# EAGLE design generic_control_board (EAGLE 5.01)
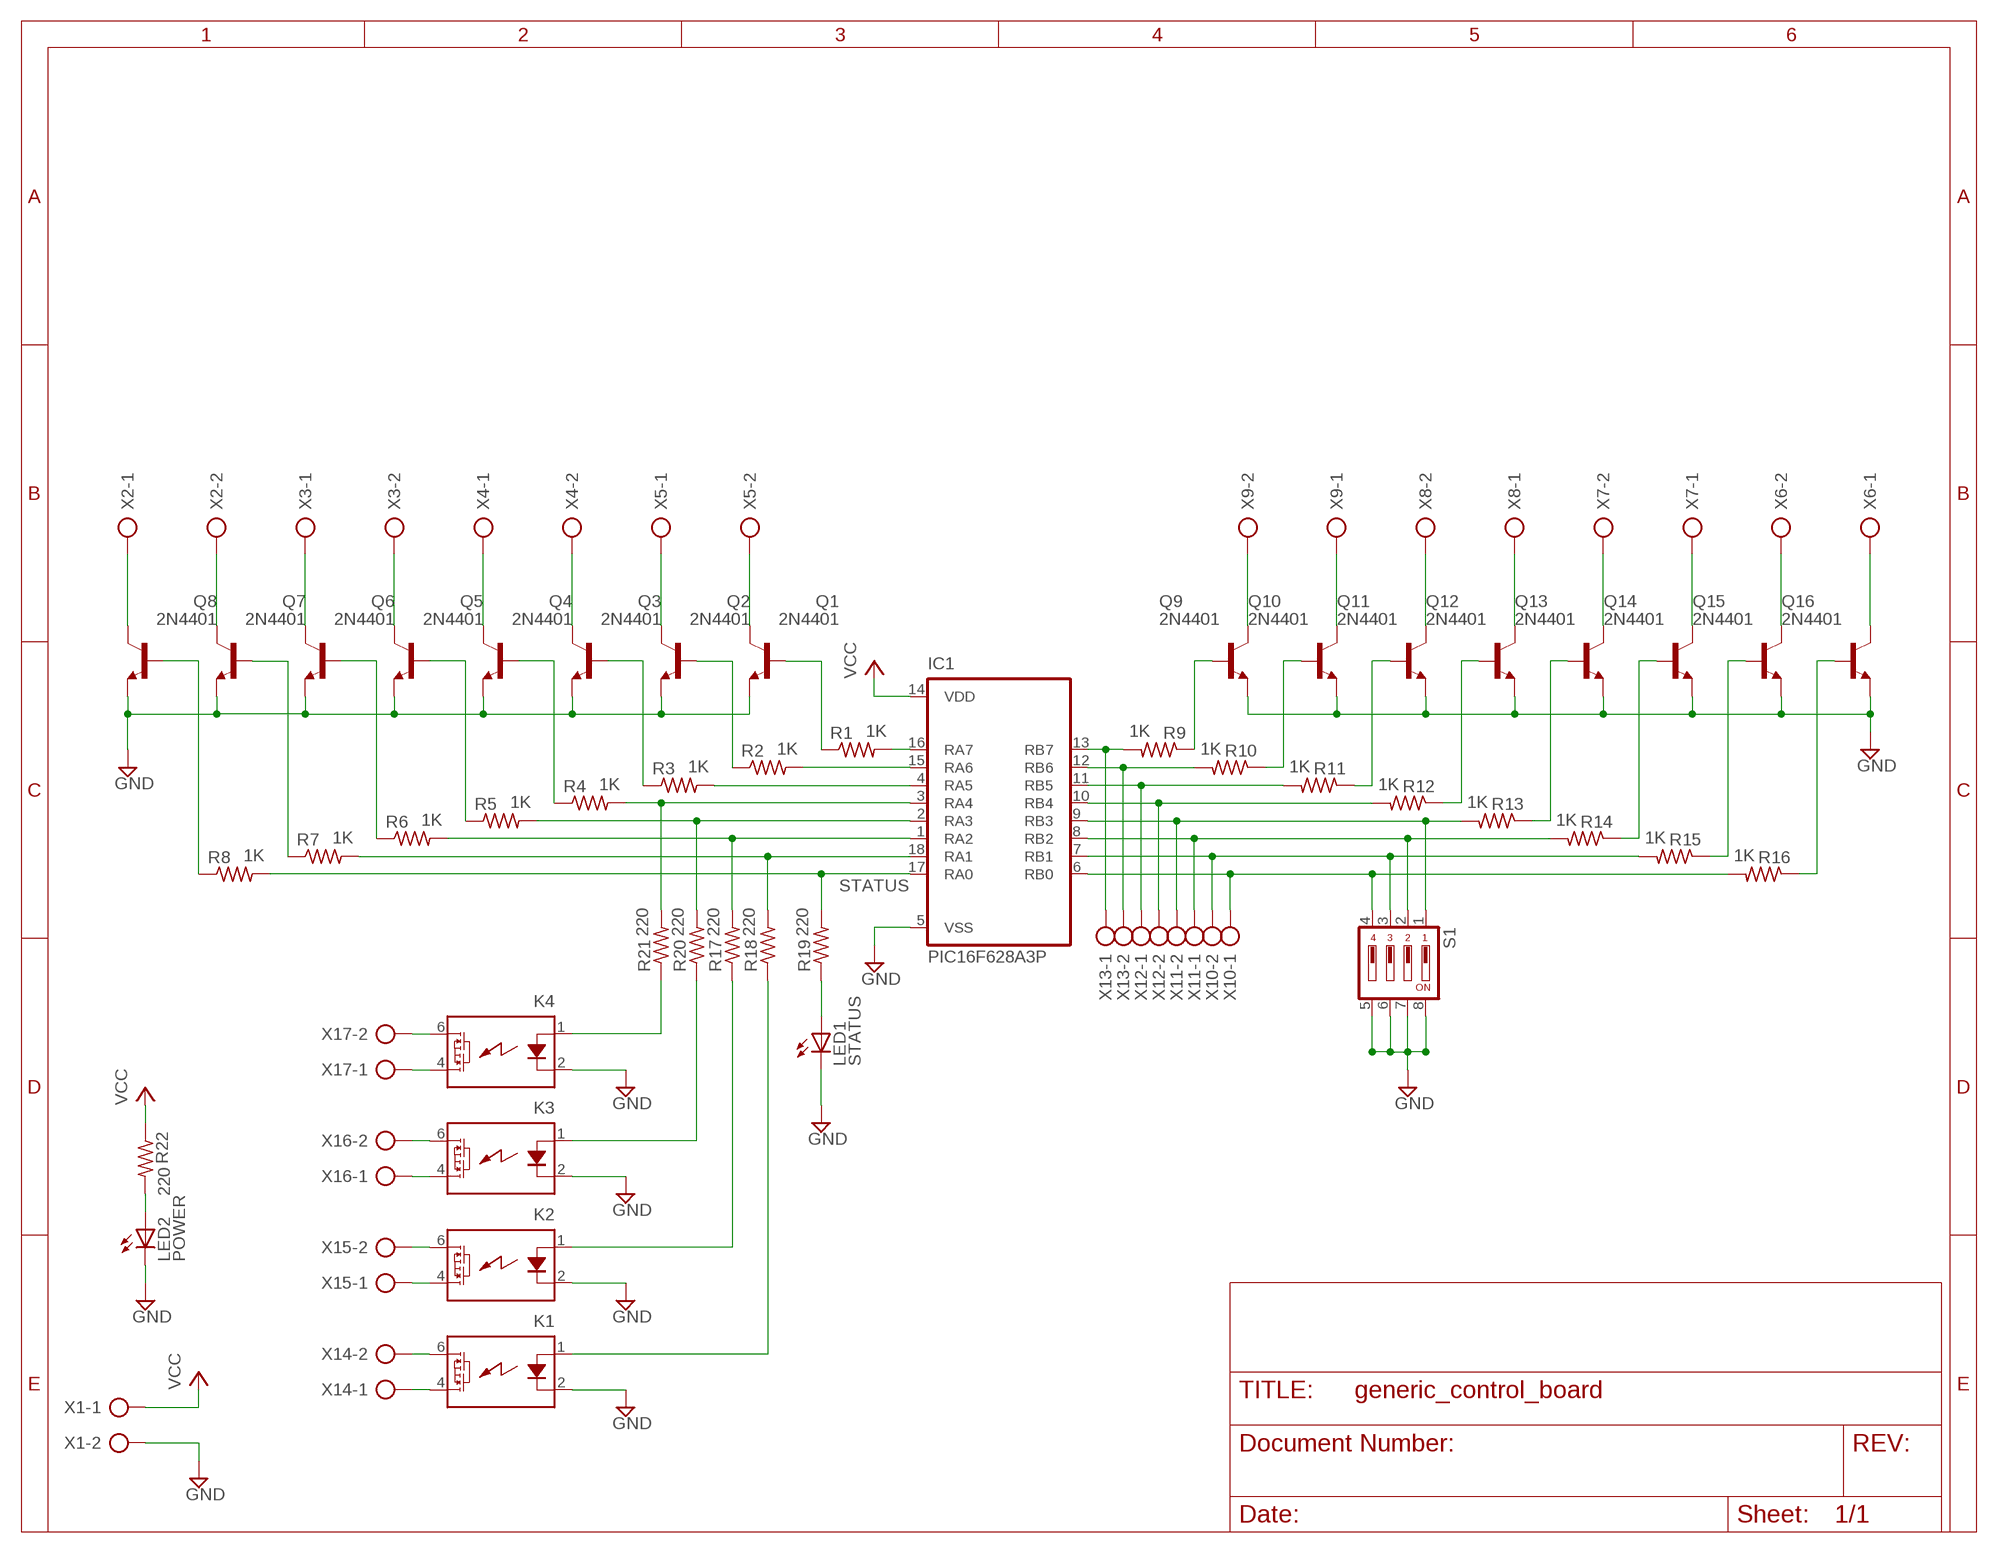
[diagram p0: schematic, sheet 1]

## Parts
IC1  PIC16F628A3P  [DIL18]
K1  LCA110  [DIL06]
K2  LCA110  [DIL06]
K3  LCA110  [DIL06]
K4  LCA110  [DIL06]
LED1  STATUS  LED3MM  [LED3MM]
LED2  POWER  LED3MM  [LED3MM]
Q1  2N4401  [TO92]
Q2  2N4401  [TO92]
Q3  2N4401  [TO92]
Q4  2N4401  [TO92]
Q5  2N4401  [TO92]
Q6  2N4401  [TO92]
Q7  2N4401  [TO92]
Q8  2N4401  [TO92]
Q9  2N4401  [TO92]
Q10  2N4401  [TO92]
Q11  2N4401  [TO92]
Q12  2N4401  [TO92]
Q13  2N4401  [TO92]
Q14  2N4401  [TO92]
Q15  2N4401  [TO92]
Q16  2N4401  [TO92]
R1  1K  R-US_0207/2V  [0207/2V]
R2  1K  R-US_0207/2V  [0207/2V]
R3  1K  R-US_0207/2V  [0207/2V]
R4  1K  R-US_0207/2V  [0207/2V]
R5  1K  R-US_0207/2V  [0207/2V]
R6  1K  R-US_0207/2V  [0207/2V]
R7  1K  R-US_0207/2V  [0207/2V]
R8  1K  R-US_0207/2V  [0207/2V]
R9  1K  R-US_0207/2V  [0207/2V]
R10  1K  R-US_0207/2V  [0207/2V]
R11  1K  R-US_0207/2V  [0207/2V]
R12  1K  R-US_0207/2V  [0207/2V]
R13  1K  R-US_0207/2V  [0207/2V]
R14  1K  R-US_0207/2V  [0207/2V]
R15  1K  R-US_0207/2V  [0207/2V]
R16  1K  R-US_0207/2V  [0207/2V]
R17  220  R-US_0207/2V  [0207/2V]
R18  220  R-US_0207/2V  [0207/2V]
R19  220  R-US_0207/2V  [0207/2V]
R20  220  R-US_0207/2V  [0207/2V]
R21  220  R-US_0207/2V  [0207/2V]
R22  220  R-US_0207/2V  [0207/2V]
S1  DIP04YL  [DIP04YL]
X1  AK500/2  [AK500/2]
X2  AK500/2  [AK500/2]
X3  AK500/2  [AK500/2]
X4  AK500/2  [AK500/2]
X5  AK500/2  [AK500/2]
X6  AK500/2  [AK500/2]
X7  AK500/2  [AK500/2]
X8  AK500/2  [AK500/2]
X9  AK500/2  [AK500/2]
X10  AK500/2  [AK500/2]
X11  AK500/2  [AK500/2]
X12  AK500/2  [AK500/2]
X13  AK500/2  [AK500/2]
X14  AK500/2  [AK500/2]
X15  AK500/2  [AK500/2]
X16  AK500/2  [AK500/2]
X17  AK500/2  [AK500/2]

## Nets
AC1-A: K1.6(D1) X14.2
AC1-B: K1.4(D2) X14.1
AC2-A: K2.6(D1) X15.2
AC2-B: K2.4(D2) X15.1
AC3-A: K3.6(D1) X16.2
AC3-B: K3.4(D2) X16.1
AC4-A: K4.6(D1) X17.2
AC4-B: K4.4(D2) X17.1
AOUT1: Q8.1(C) X2.1
AOUT2: Q7.1(C) X2.2
AOUT3: Q6.1(C) X3.1
AOUT4: Q5.1(C) X3.2
AOUT5: Q4.1(C) X4.1
AOUT6: Q3.1(C) X4.2
AOUT7: Q2.1(C) X5.1
AOUT8: Q1.1(C) X5.2
BOUT1: Q16.1(C) X6.1
BOUT2: Q15.1(C) X6.2
BOUT3: Q14.1(C) X7.1
BOUT4: Q13.1(C) X7.2
BOUT5: Q12.1(C) X8.1
BOUT6: Q11.1(C) X8.2
BOUT7: Q10.1(C) X9.1
BOUT8: Q9.1(C) X9.2
GND: IC1.5(VSS) K1.2(K) K2.2(K) K3.2(K) K4.2(K) LED1.K(C) LED2.K(C) Q1.3(E) Q2.3(E) Q3.3(E) Q4.3(E) Q5.3(E) Q6.3(E) Q7.3(E) Q8.3(E) Q9.3(E) Q10.3(E) Q11.3(E) Q12.3(E) Q13.3(E) Q14.3(E) Q15.3(E) Q16.3(E) S1.5 S1.6 S1.7 S1.8 X1.2
IN1: IC1.6(RB0) R16.2 S1.4 X10.1
IN2: IC1.7(RB1) R15.2 S1.3 X10.2
IN3: IC1.8(RB2) R14.2 S1.2 X11.1
IN4: IC1.9(RB3) R13.2 S1.1 X11.2
IN5: IC1.10(RB4) R12.2 X12.2
IN6: IC1.11(RB5) R11.2 X12.1
IN7: IC1.12(RB6) R10.2 X13.2
IN8: IC1.13(RB7) R9.2 X13.1
N$3: Q11.2(B) R11.1
N$4: Q8.2(B) R8.1
N$5: Q1.2(B) R1.1
N$7: Q2.2(B) R2.1
N$8: Q3.2(B) R3.1
N$9: Q4.2(B) R4.1
N$10: Q5.2(B) R5.1
N$11: Q12.2(B) R12.1
N$12: Q13.2(B) R13.1
N$13: Q14.2(B) R14.1
N$14: Q6.2(B) R6.1
N$21: IC1.16(RA7) R1.2
N$22: Q7.2(B) R7.1
N$23: Q15.2(B) R15.1
N$24: IC1.15(RA6) R2.2
N$26: IC1.4(RA5) R3.2
N$27: IC1.3(RA4) R4.2 R21.2
N$28: IC1.2(RA3) R5.2 R20.2
N$29: IC1.1(RA2) R6.2 R17.2
N$30: IC1.18(RA1) R7.2 R18.2
N$31: Q16.2(B) R16.1
N$32: LED1.A R19.1
N$33: Q9.2(B) R9.1
N$48: K2.1(A) R17.1
N$49: K1.1(A) R18.1
N$51: Q10.2(B) R10.1
N$55: K4.1(A) R21.1
N$56: K3.1(A) R20.1
N$61: LED2.A R22.2
STATUS: IC1.17(RA0) R8.2 R19.2
VCC: IC1.14(VDD) R22.1 X1.1

## Library data of the parts
IC1 = microchip:PIC16F628A: MICROCONTROLLER 8-Bit PIC16F628 Family - CMOS Flash/EEPROM Pin Compatible : PIC16F83, PIC16CR83, PIC16F84A, PIC16CR84 see also PIC16C*
K1-K4 = relay:LCA110: Solid state relay. Clare LCA110
LED1 LED2 = led:LED: LED OSRAM: - CHIPLED LG R971, LG N971, LY N971, LG Q971, LY Q971, LO R971, LY R971 LH N974, LH R974 LS Q976, LO Q976, LY Q976 LO Q996 - Hyper CHIPLED LW Q18S LB Q993, LB Q99A, LB R99A - SideLED LS A670, LO A670, LY A670, LG A670, LP A670 LB A673, LV A673, LT A673, LW A673 LH A674 LY A675 LS A676, LA A676, LO A676, LY A676, LW A676 LS A679, LY A679, LG A679 - Hyper Micro SIDELED® LS Y876, LA Y876, LO Y876, LY Y876 LT Y87S - SmartLED LW L88C, LW L88S LB L89C, LB L89S, LG L890 LS L89K, LO L89K, LY L89K LS L896, LA L896, LO L896, LY L896 - TOPLED LS T670, LO T670, LY T670, LG T670, LP T670 LSG T670, LSP T670, LSY T670, LOP T670, LYG T670 LG T671, LOG T671, LSG T671 LB T673, LV T673, LT T673, LW T673 LH T674 LS T676, LA T676, LO T676, LY T676, LB T676, LH T676, LSB T676, LW T676 LB T67C, LV T67C, LT T67C, LS T67K, LO T67K, LY T67K, LW E67C LS E67B, LA E67B, LO E67B, LY E67B, LB E67C, LV E67C, LT E67C LW T67C LS T679, LY T679, LG T679 LS T770, LO T770, LY T770, LG T770, LP T770 LB T773, LV T773, LT T773, LW T773 LH T774 LS E675, LA E675, LY E675, LS T675 LS T776, LA T776, LO T776, LY T776, LB T776 LHGB T686 LT T68C, LB T68C - Hyper Mini TOPLED® LB M676 - Mini TOPLED Santana® LG M470 LS M47K, LO M47K, LY M47K Source: http://www.osram.convergy.de - LUMILED® LXK2-PW12-R00, LXK2-PW12-S00, LXK2-PW14-U00, LXK2-PW14-V00 LXK2-PM12-R00, LXK2-PM12-S00, LXK2-PM14-U00 LXK2-PE12-Q00, LXK2-PE12-R00, LXK2-PE12-S00, LXK2-PE14-T00, LXK2-PE14-U00 LXK2-PB12-K00, LXK2-PB12-L00, LXK2-PB12-M00, LXK2-PB14-N00, LXK2-PB14-P00, LXK2-PB14-Q00 LXK2-PR12-L00, LXK2-PR12-M00, LXK2-PR14-Q00, LXK2-PR14-R00 LXK2-PD12-Q00, LXK2-PD12-R00, LXK2-PD12-S00 LXK2-PH12-R00, LXK2-PH12-S00 LXK2-PL12-P00, LXK2-PL12-Q00, LXK2-PL12-R00 Source: www.luxeon.com
Q1-Q16 = transistor-npn:2N4401: NPN Transistor
R1-R22 = rcl:R-US_: RESISTOR, American symbol
S1 = switch-dil:DIP04YL: DIL/CODE SWITCH
X1-X17 = con-ptr500:AK500/2: CONNECTOR

## Board
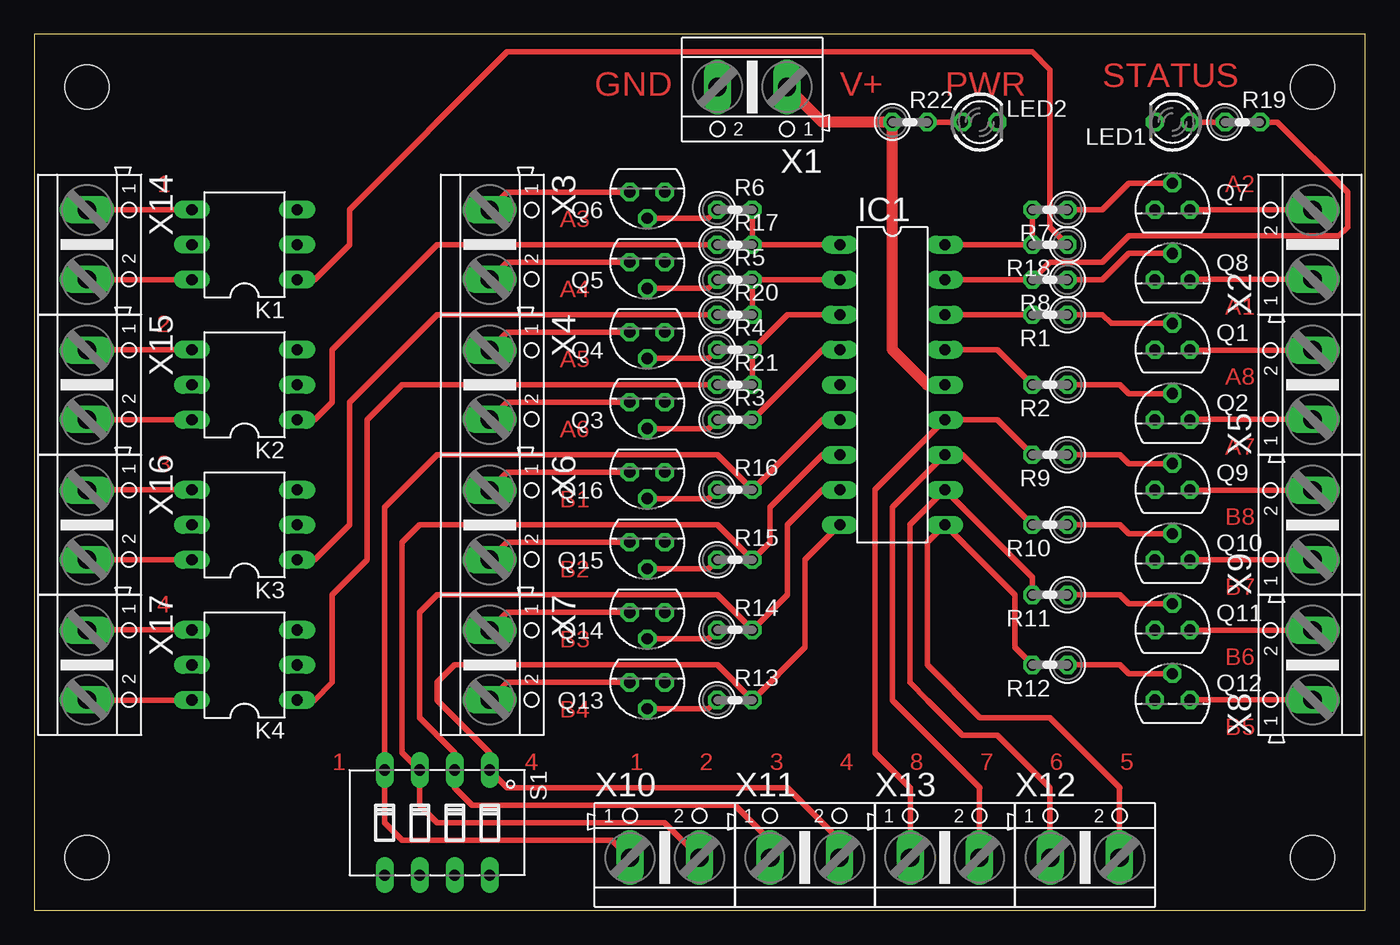
[diagram p1: board, top side]
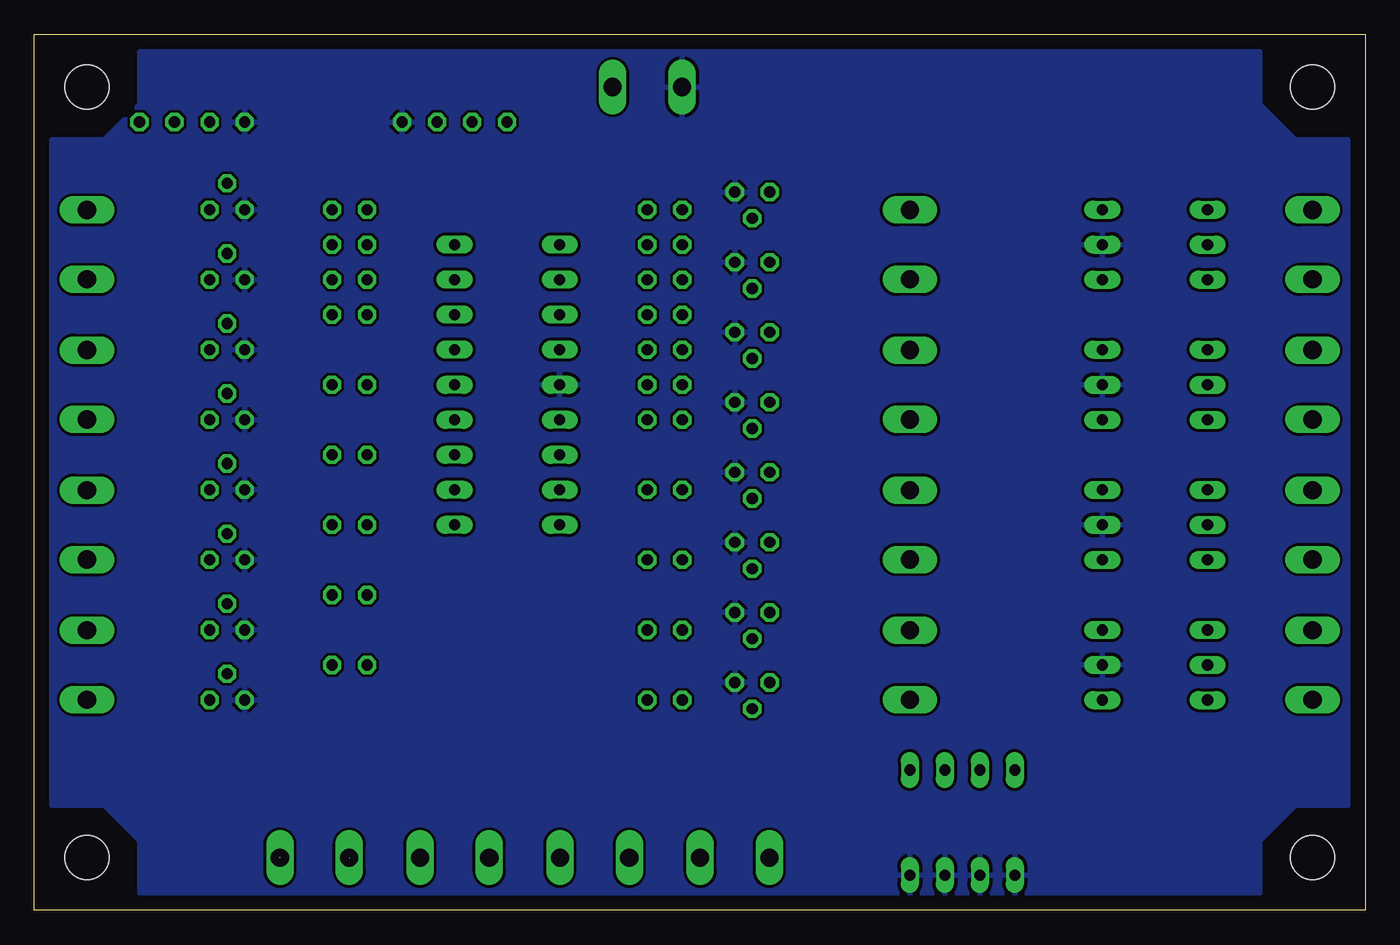
[diagram p2: board, bottom side, seen from below]

Size 96.52 x 63.5 mm. Coordinates in mm from the lower left corner, seen from the top.
Outline: 0,0 96.52,0 96.52,63.5 0,63.5 0,0
Copper layers (1*16): Top 0.035mm / dielectric 1.5mm / Bottom 0.035mm
Design rules "default *": minimum track width 10mil, minimum drill 24mil, track to track 8mil, track to pad 12mil, pad to pad 8mil, via to via 8mil, smd to smd 8mil, copper to edge 40mil, drill to drill 8mil, minimum pad ring 10mil, minimum via ring 8mil, stop-mask expansion 4mil, vias tented up to drill 0mil, thermal gap 10mil
Holes 3.2 mm at 92.71,59.69 92.71,3.81 3.81,3.81 3.81,59.69

### Footprints (pad centres in the part's own frame; a part is rotated, then mirrored left to right if it is on the bottom)
DIL18 = drill 0.813 long: 1 -10.16,-3.81; 2 -7.62,-3.81; 3 -5.08,-3.81; 4 -2.54,-3.81; 5 0,-3.81; 6 2.54,-3.81; 7 5.08,-3.81; 8 7.62,-3.81; 9 10.16,-3.81; 10 10.16,3.81; 11 7.62,3.81; 12 5.08,3.81; 13 2.54,3.81; 14 0,3.81; 15 -2.54,3.81; 16 -5.08,3.81; 17 -7.62,3.81; 18 -10.16,3.81
DIL06 = drill 0.813 long: 1 -2.54,-3.81; 2 0,-3.81; 3 2.54,-3.81; 4 2.54,3.81; 5 0,3.81; 6 -2.54,3.81
LED3MM = drill 0.813 octagon: A -1.27,0; K 1.27,0
TO92 = drill 0.813 octagon: 1 1.27,0; 2 0,1.905; 3 -1.27,0
0207/2V = drill 0.813 octagon: 1 -1.27,0; 2 1.27,0
DIP04YL = drill 0.813 long: 1 -3.81,-3.81; 2 -1.27,-3.81; 3 1.27,-3.81; 4 3.81,-3.81; 5 3.81,3.81; 6 1.27,3.81; 7 -1.27,3.81; 8 -3.81,3.81
AK500/2 = drill 1.321 long: 1 -2.515,0; 2 2.515,0

### Placement (x,y rotation side)
IC1  62.23,38.1 270 top
K1  15.24,48.26 90 top
K2  15.24,38.1 90 top
K3  15.24,27.94 90 top
K4  15.24,17.78 90 top
LED1  82.55,57.15 180 top
LED2  68.58,57.15 0 top
Q1  82.55,40.64 0 top
Q2  82.55,35.56 0 top
Q3  44.45,36.83 180 top
Q4  44.45,41.91 180 top
Q5  44.45,46.99 180 top
Q6  44.45,52.07 180 top
Q7  82.55,50.8 0 top
Q8  82.55,45.72 0 top
Q9  82.55,30.48 0 top
Q10  82.55,25.4 0 top
Q11  82.55,20.32 0 top
Q12  82.55,15.24 0 top
Q13  44.45,16.51 180 top
Q14  44.45,21.59 180 top
Q15  44.45,26.67 180 top
Q16  44.45,31.75 180 top
R1  73.66,43.18 180 top
R2  73.66,38.1 180 top
R3  50.8,35.56 0 top
R4  50.8,40.64 0 top
R5  50.8,45.72 0 top
R6  50.8,50.8 0 top
R7  73.66,50.8 180 top
R8  73.66,45.72 180 top
R9  73.66,33.02 180 top
R10  73.66,27.94 180 top
R11  73.66,22.86 180 top
R12  73.66,17.78 180 top
R13  50.8,15.24 0 top
R14  50.8,20.32 0 top
R15  50.8,25.4 0 top
R16  50.8,30.48 0 top
R17  50.8,48.26 0 top
R18  73.66,48.26 180 top
R19  87.63,57.15 0 top
R20  50.8,43.18 0 top
R21  50.8,38.1 0 top
R22  63.5,57.15 0 top
S1  29.21,6.35 180 top
X1  52.07,59.69 180 top
X2  92.71,48.26 90 top
X3  33.02,48.26 270 top
X4  33.02,38.1 270 top
X5  92.71,38.1 90 top
X6  33.02,27.94 270 top
X7  33.02,17.78 270 top
X8  92.71,17.78 90 top
X9  92.71,27.94 90 top
X10  45.72,3.81 0 top
X11  55.88,3.81 0 top
X12  76.2,3.81 0 top
X13  66.04,3.81 0 top
X14  3.81,48.26 270 top
X15  3.81,38.1 270 top
X16  3.81,27.94 270 top
X17  3.81,17.78 270 top

### Tracks (layer width: path | path; a pad name or v marks a point on that pad's centre or on a via)
AC1-A
  Top 0.406: X14.2 3.81,45.72 K1.6
AC1-B
  Top 0.406: X14.1 3.81,50.8 K1.4
AC2-A
  Top 0.406: X15.2 3.81,35.56 K2.6
AC2-B
  Top 0.406: X15.1 3.81,40.64 K2.4
AC3-A
  Top 0.406: X16.2 3.81,25.4 K3.6
AC3-B
  Top 0.406: X16.1 3.81,30.48 K3.4
AC4-A
  Top 0.406: X17.2 3.81,15.24 K4.6
AC4-B
  Top 0.406: X17.1 3.81,20.32 K4.4
AOUT1
  Top 0.406: X2.1 83.84,45.74 Q8.1
AOUT2
  Top 0.406: X2.2 83.84,50.77 Q7.1
AOUT3
  Top 0.406: X3.1 33.02,50.8 34.29,52.07 Q6.1
AOUT4
  Top 0.406: X3.2 33.02,45.72 34.29,46.99 Q5.1
AOUT5
  Top 0.406: X4.1 33.02,40.64 34.29,41.91 Q4.1
AOUT6
  Top 0.406: X4.2 33.02,35.56 34.29,36.83 Q3.1
AOUT7
  Top 0.406: X5.1 83.84,35.59 Q2.1
AOUT8
  Top 0.406: X5.2 83.84,40.62 Q1.1
BOUT1
  Top 0.406: X6.1 33.02,30.48 34.29,31.75 Q16.1
BOUT2
  Top 0.406: X6.2 33.02,25.4 34.29,26.67 Q15.1
BOUT3
  Top 0.406: X7.1 33.02,20.32 34.29,21.59 Q14.1
BOUT4
  Top 0.406: X7.2 33.02,15.24 34.29,16.51 Q13.1
BOUT5
  Top 0.406: X8.1 83.84,15.27 Q12.1
BOUT6
  Top 0.406: X8.2 83.84,20.3 Q11.1
BOUT7
  Top 0.406: X9.1 83.84,25.43 Q10.1
BOUT8
  Top 0.406: X9.2 83.84,30.45 Q9.1
GND
  pour Bottom: 1.27,55.88 5.08,55.88 7.62,58.42 7.62,62.23 88.9,62.23 88.9,58.42 91.44,55.88 95.25,55.88 95.25,7.62 91.44,7.62 88.9,5.08 88.9,1.27 7.62,1.27 7.62,5.08 5.08,7.62 1.27,7.62
IN1
  Top 0.406: X10.1 43.18,3.81 41.91,5.08 26.67,5.08 25.4,6.35 S1.4 25.4,29.21 29.21,33.02 49.53,33.02 R16.2 57.15,35.56 IC1.6
IN2
  Top 0.406: X10.2 48.26,3.81 45.72,6.35 29.21,6.35 27.94,7.62 S1.3 26.67,11.43 26.67,26.67 27.94,27.94 49.53,27.94 R15.2 53.34,26.67 53.34,29.21 57.15,33.02 IC1.7
IN3
  Top 0.406: X11.1 53.37,5.05 50.8,7.62 31.75,7.62 30.48,8.89 S1.2 30.48,11.43 27.94,13.97 27.94,21.59 29.21,22.86 49.53,22.86 R14.2 54.61,22.86 54.61,27.94 57.15,30.48 IC1.8
IN4
  Top 0.406: X11.2 58.4,5.11 54.61,8.89 34.29,8.89 S1.1 33.02,11.43 29.21,15.24 29.21,16.51 30.48,17.78 49.53,17.78 R13.2 55.88,19.05 55.88,25.4 IC1.9
IN5  (1 unrouted)
  Top 0.406: R12.2 71.12,19.05 71.12,22.86 IC1.10 64.77,26.67 64.77,17.78 68.58,13.97 73.66,13.97 76.2,11.43 78.74,8.89 78.72,8.87 78.72,3.83
IN6  (1 unrouted)
  Top 0.406: R11.2 72.39,24.13 IC1.11 63.5,27.94 63.5,16.51 64.77,15.24 67.31,12.7 69.85,12.7 73.66,8.89 73.66,3.81
IN7
  Top 0.406: R10.2 67.31,33.02 IC1.12 62.23,29.21 62.23,15.24 64.77,12.7 68.58,8.89 68.56,8.87 X13.2
IN8
  Top 0.406: R9.2 69.85,35.56 IC1.13 60.96,30.48 60.96,11.43 63.5,8.89 63.52,8.87 X13.1
N$3
  Top 0.406: Q11.2 79.38,22.23 78.74,22.86 R11.1
N$4
  Top 0.406: Q8.2 79.38,47.62 77.47,45.72 R8.1
N$5
  Top 0.406: Q1.2 78.11,42.55 77.47,43.18 R1.1
N$7
  Top 0.406: Q2.2 79.38,37.47 78.74,38.1 R2.1
N$8
  Top 0.406: Q3.2 48.9,34.92 R3.1
N$9
  Top 0.406: Q4.2 48.9,40.01 R4.1
N$10
  Top 0.406: Q5.2 48.9,45.09 R5.1
N$11
  Top 0.406: Q12.2 79.38,17.14 78.74,17.78 R12.1
N$12
  Top 0.406: Q13.2 48.9,14.61 R13.1
N$13
  Top 0.406: Q14.2 48.9,19.68 R14.1
N$14
  Top 0.406: Q6.2 48.9,50.16 R6.1
N$21
  Top 0.406: IC1.16 R1.2
N$22
  Top 0.406: Q7.2 79.38,52.7 77.47,50.8 R7.1
N$23
  Top 0.406: Q15.2 48.9,24.77 R15.1
N$24
  Top 0.406: R2.2 69.85,40.64 IC1.15
N$26
  Top 0.406: IC1.4 57.15,40.64 R3.2
N$27
  Top 0.406: R21.2 R4.2 54.61,43.18 IC1.3
N$28
  Top 0.406: IC1.2 R5.2 R20.2
N$29
  Top 0.406: IC1.1 R17.2 R6.2
N$30
  Top 0.406: R7.2 R18.2 IC1.18
N$31
  Top 0.406: Q16.2 48.9,29.84 R16.1
N$32
  Top 0.406: LED1.A R19.1
N$33
  Top 0.406: Q9.2 79.38,32.38 78.74,33.02 R9.1
N$48
  Top 0.406: R17.1 29.21,48.26 21.59,40.64 21.59,36.83 20.32,35.56 K2.1
N$49
  Top 0.406: K1.1 20.32,45.72 22.86,48.26 22.86,50.8 34.29,62.23 72.39,62.23 73.66,60.96 73.66,49.53 R18.1
N$51
  Top 0.406: Q10.2 79.38,27.3 78.74,27.94 R10.1
N$55
  Top 0.406: K4.1 20.32,15.24 21.59,16.51 21.59,22.86 24.13,25.4 24.13,35.56 26.67,38.1 R21.1
N$56
  Top 0.406: K3.1 20.32,25.4 22.86,27.94 22.86,36.83 29.21,43.18 R20.1
N$61
  Top 0.406: R22.2 LED2.A
STATUS
  Top 0.406: R8.2 IC1.17 R8.2 | R19.2 90.17,57.15 95.25,52.07 95.25,49.53 94.61,48.9 79.38,48.9 77.47,46.99 73.66,46.99 R8.2
VCC
  Top 0.813: X1.1 54.61,59.69 57.15,57.15 R22.1 62.23,40.64 64.77,38.1 IC1.14

### Text on the board
Top: STATUS | GND | V+ | PWR | 1 | A2 | A3 | A4 | A1 | 2 | A5 | A8 | A6 | A7 | 3 | B1 | B8 | B2 | B7 | 4 | B3 | B6 | B4 | B5 | 1 | 4 | 1 | 2 | 3 | 4 | 8 | 7 | 6 | 5